# EAGLE design microwwvb (EAGLE 7.5.0)
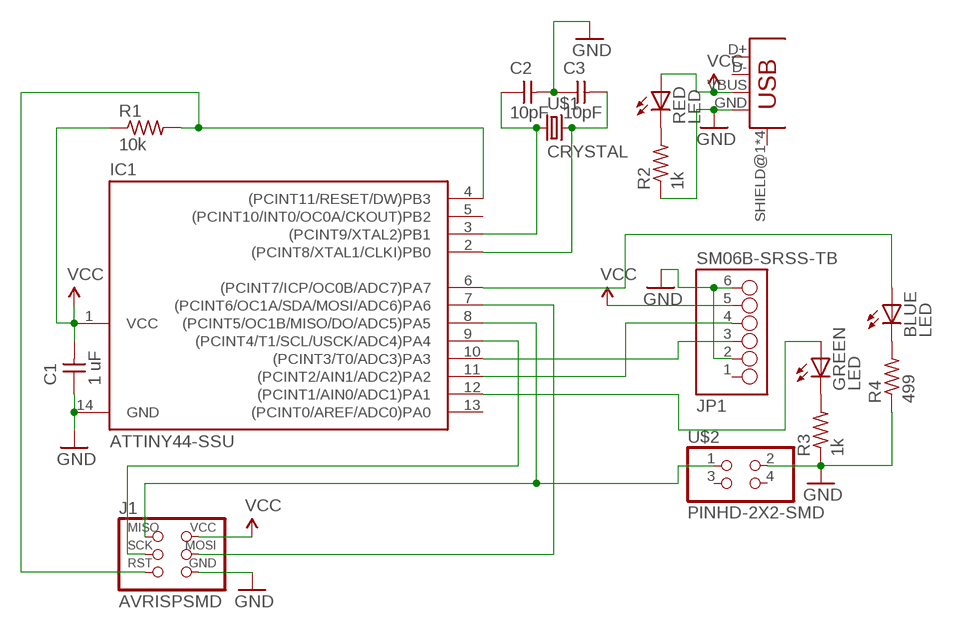
[diagram p0: schematic, sheet 1]

## Parts
BLUE  LED  [LED1206]
C1  1 uF  CAP-UNPOLARIZED  [C1206]
C2  10pF  CAP-UNPOLARIZED  [C1206]
C3  10pF  CAP-UNPOLARIZED  [C1206]
GREEN  LED  [LED1206]
IC1  ATTINY44-SSU  [SOIC14]
J1  AVRISPSMD  [2X03SMD]
JP1  SM06B-SRSS-TB  [SM06B-SRSS-TB]
R1  10k  RES-US1206  [R1206]
R2  1k  RES-US1206  [R1206]
R3  1k  RES-US1206  [R1206]
R4  499  RES-US1206  [R1206]
RED  LED  [LED1206]
U$1  CRYSTAL  [2-SMD-5X3MM]
U$2  PINHD-2X2-SMD  [2X02SMD]
U$3  USB_MINIB  [USB_MINIB]

## Nets
GND: C1.1 C2.2 C3.1 IC1.14(GND) J1.6(GND) JP1.2 JP1.6 R2.1 R3.1 R4.1 U$2.2 U$3.GND
N$1: C3.2 IC1.2((PCINT8/XTAL1/CLKI)PB0) U$1.P$2
N$2: C2.1 IC1.3((PCINT9/XTAL2)PB1) U$1.P$1
N$3: IC1.4((PCINT11/RESET/DW)PB3) J1.5(RST) R1.2
N$4: IC1.8((PCINT5/OC1B/MISO/DO/ADC5)PA5) J1.1(MISO) U$2.1
N$5: IC1.7((PCINT6/OC1A/SDA/MOSI/ADC6)PA6) J1.4(MOSI)
N$6: R2.2 RED.2(C)
N$7: GREEN.2(C) R3.2
N$8: IC1.10((PCINT3/T0/ADC3)PA3) JP1.3
N$9: IC1.9((PCINT4/T1/SCL/USCK/ADC4)PA4) J1.3(SCK)
N$10: IC1.11((PCINT2/AIN1/ADC2)PA2) JP1.4
N$12: GREEN.1(A) IC1.12((PCINT1/AIN0/ADC1)PA1)
N$13: BLUE.2(C) R4.2
N$14: BLUE.1(A) IC1.6((PCINT7/ICP/OC0B/ADC7)PA7)
VCC: C1.2 IC1.1(VCC) J1.2(VCC) JP1.5 R1.1 RED.1(A) U$3.VBUS
Unconnected: IC1.5((PCINT10/INT0/OC0A/CKOUT)PB2) IC1.13((PCINT0/AREF/ADC0)PA0) JP1.1 U$2.3 U$2.4 U$3.D+ U$3.D- U$3.SHIELD@1(SHIELD) U$3.SHIELD@2(SHIELD) U$3.SHIELD@3(SHIELD) U$3.SHIELD@4(SHIELD)

## Library data of the parts
BLUE GREEN RED = fab:LED: LED
C1-C3 = fab:CAP-UNPOLARIZED
IC1 = fab:ATTINY44
J1 = fab:AVRISP
JP1 = con-jst-sh:SM06B-SRSS-TB
R1-R4 = fab:RES-US: Resistor (US Symbol) Variants with postfix FAB are widened to allow the routing of internal traces
U$1 = fab:CRYSTAL
U$2 = fab:PINHD-2X2-SMD
U$3 = fab:USB_MINIB

## Board
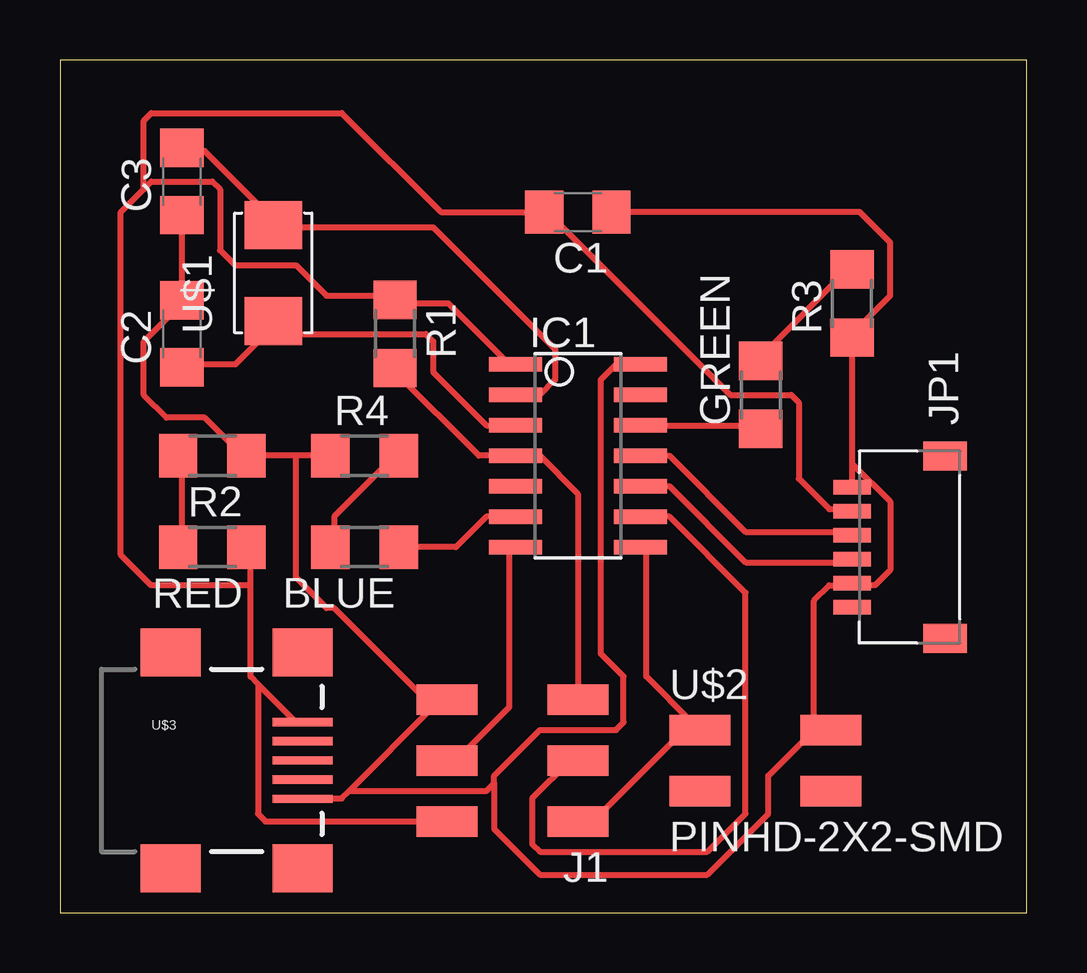
[diagram p1: board, top side]

Size 40.31 x 35.55 mm. Coordinates in mm from the lower left corner, seen from the top.
Outline: 0,0 40.31,0 40.31,35.55 0,35.55 0,0
Copper layers 1+16: Top 0.035mm / dielectric 1.5mm / Bottom 0.035mm
Design rules "fablab_17mils *": minimum track width 10mil, minimum drill 0.8mm, track to track 16mil, track to pad 16mil, pad to pad 16mil, via to via 16mil, smd to smd 16mil, copper to edge 16mil, drill to drill 16mil, minimum pad ring 0.8mm, minimum via ring 0.8mm, stop-mask expansion 4mil, vias tented up to drill 0mil, thermal gap 1mm

### Footprints (pad centres in the part's own frame; a part is rotated, then mirrored left to right if it is on the bottom)
LED1206 = smd 1.6 x 1.803: 1 -1.422,0; 2 1.422,0
C1206 = smd 1.6 x 1.8: 1 -1.4,0; 2 1.4,0
SOIC14 = smd 0.61 x 2.21: 1 -3.81,-2.603; 2 -2.54,-2.603; 3 -1.27,-2.603; 4 0,-2.603; 5 1.27,-2.603; 6 2.54,-2.603; 7 3.81,-2.603; 8 3.81,2.603; 9 2.54,2.603; 10 1.27,2.603; 11 0,2.603; 12 -1.27,2.603; 13 -2.54,2.603; 14 -3.81,2.603
2X03SMD = smd 2.54 x 1.27: 1 -2.54,2.54; 2 2.92,2.54; 3 -2.54,0; 4 2.92,0; 5 -2.54,-2.54; 6 2.92,-2.54
SM06B-SRSS-TB = smd 0.6 x 1.55: 1 -2.5,0; 2 -1.5,0; 3 -0.5,0; 4 0.5,0; 5 1.5,0; 6 2.5,0 | smd 1.2 x 1.8: P-MOUNT1 -3.8,-3.875; P-MOUNT2 3.8,-3.875
R1206 = smd 1.6 x 1.803: 1 -1.422,0; 2 1.422,0
2-SMD-5X3MM = smd 2 x 2.4: P$1 -2,0; P$2 2,0
2X02SMD = smd 2.54 x 1.27: 1 -2.54,1.27; 2 2.92,1.27; 3 -2.54,-1.27; 4 2.92,-1.27
USB_MINIB = smd 2.5 x 0.35: D+ 3.77,0; D- 3.77,0.8; GND 3.77,-1.6; ID 3.77,-0.8; VBUS 3.77,1.6 | smd 2.5 x 2: SHIELD@1 -1.73,-4.5; SHIELD@2 -1.73,4.5; SHIELD@3 3.77,4.5; SHIELD@4 3.77,-4.5

### Placement (x,y rotation side)
BLUE  12.7,15.24 180 top
C1  21.59,29.21 180 top
C2  5.08,24.13 90 top
C3  5.08,30.48 90 top
GREEN  29.21,21.59 90 top
IC1  21.59,19.05 270 top
J1  19.05,6.35 180 top
JP1  33.02,15.24 90 top
R1  13.97,24.13 270 top
R2  6.35,19.05 180 top
R3  33.02,25.4 90 top
R4  12.7,19.05 0 top
RED  6.35,15.24 180 top
U$1  8.89,26.67 90 top
U$2  29.21,6.35 0 top
U$3  6.35,6.35 0 top

### Tracks (layer width: path | path; a pad name or v marks a point on that pad's centre or on a via)
GND
  Top 0.254: 33.02,13.65 32.07,13.65 31.43,13.02 31.43,8.26 31.75,7.94 | 31.75,7.94 32.07,7.62 U$2.2 31.75,7.94 | 33.02,18.73 R3.1 33.02,24.13 34.61,25.72 34.61,27.94 33.34,29.21 C1.1 | 33.02,18.73 JP1.6 | 33.02,13.65 33.97,13.65 34.61,14.29 34.61,17.14 33.02,18.73 | 33.02,13.65 JP1.2 | C3.1 C2.2 5.08,25.4 3.49,23.81 3.49,21.59 4.45,20.64 6.03,20.64 7.62,19.05 R2.1 9.84,19.05 | R4.1 9.84,19.05 | IC1.14 23.18,22.86 22.54,22.23 22.54,10.79 23.5,9.84 23.5,7.94 23.18,7.62 20,7.62 18.1,5.71 18.1,5.4 | 18.1,5.4 17.78,5.08 12.06,5.08 | 12.06,5.08 11.75,4.76 10.16,4.76 U$3.GND | 12.06,5.08 15.56,8.57 | 15.56,8.57 15.88,8.89 J1.6 15.56,8.57 | 9.84,19.05 9.84,13.97 11.11,12.7 11.43,12.7 15.56,8.57 | 31.75,7.94 29.53,5.71 29.53,4.13 26.99,1.59 20,1.59 18.1,3.49 18.1,5.4
N$1
  Top 0.254: C3.2 5.08,31.75 6.03,31.75 8.89,28.89 U$1.P$2 8.89,28.57 15.56,28.57 20.64,23.5 20.64,22.23 20,21.59 IC1.2
N$2
  Top 0.254: 8.57,24.13 8.89,24.45 U$1.P$1 8.57,24.13 | 8.57,24.13 7.3,22.86 5.08,22.86 C2.1 | IC1.3 17.78,20.32 15.56,22.54 15.56,23.81 15.24,24.13 8.57,24.13
N$3
  Top 0.254: R1.2 13.97,22.54 17.46,19.05 IC1.4 20,19.05 21.59,17.46 J1.5
N$4
  Top 0.254: 26.35,7.94 24.45,9.84 24.45,15.24 IC1.8 | J1.1 22.23,3.81 26.35,7.94 | 26.35,7.94 U$2.1
N$5
  Top 0.254: J1.4 16.51,6.35 18.73,8.57 18.73,15.24 IC1.7
N$6
  Top 0.254: RED.2 5.08,15.24 5.08,19.05 R2.2
N$7
  Top 0.254: GREEN.2 29.21,23.18 33.02,26.99 R3.2
N$8
  Top 0.254: IC1.10 25.4,17.78 28.57,14.61 33.02,14.61 JP1.3
N$9
  Top 0.254: IC1.9 25.4,16.51 28.57,13.34 28.57,4.13 26.99,2.54 20,2.54 19.68,2.86 19.68,4.76 21.27,6.35 J1.3
N$10
  Top 0.254: IC1.11 25.4,19.05 28.57,15.88 33.02,15.88 JP1.4
N$12
  Top 0.254: IC1.12 29.21,20.32 GREEN.1
N$13
  Top 0.254: BLUE.2 11.43,15.24 11.43,16.51 13.97,19.05 R4.2
N$14
  Top 0.254: BLUE.1 16.51,15.24 17.78,16.51 IC1.6
VCC
  Top 0.254: JP1.5 33.02,16.83 32.07,16.83 30.8,18.1 30.8,21.27 30.48,21.59 27.94,21.59 20.32,29.21 C1.2 15.88,29.21 11.75,33.34 3.81,33.34 3.49,33.02 3.49,30.16 | IC1.1 18.73,22.86 16.19,25.4 13.97,25.4 R1.1 13.97,25.72 11.11,25.72 9.84,26.99 7.3,26.99 6.67,27.62 6.67,30.16 6.35,30.48 3.81,30.48 3.49,30.16 | 7.94,13.65 7.94,9.84 8.26,9.53 | 7.94,13.65 7.94,15.24 RED.1 | 8.26,9.53 9.84,7.94 U$3.VBUS | J1.2 8.57,3.81 8.26,4.13 8.26,9.53 | 3.49,30.16 2.54,29.21 2.54,14.92 3.81,13.65 7.94,13.65